# Altium schematic sheet P5V_Regulator.SchDoc: P5V DC/DC Converter
size 431 x 279 mm; Organization: ORGANIZATION; Address1: APPLIED PHYSICS LAB; Address2: UNIVERSITY OF WASHINGTON; Address3: 1013 NE 40TH STREET; Address4: SEATTLE, WA 98105; DocumentNumber: 6; Revision: -; SheetNumber: 6; SheetTotal: 18; ENG_APP_DATE: --/--/--; DSN_APP_DATE: --/--/--; CHK_APP_DATE: --/--/--
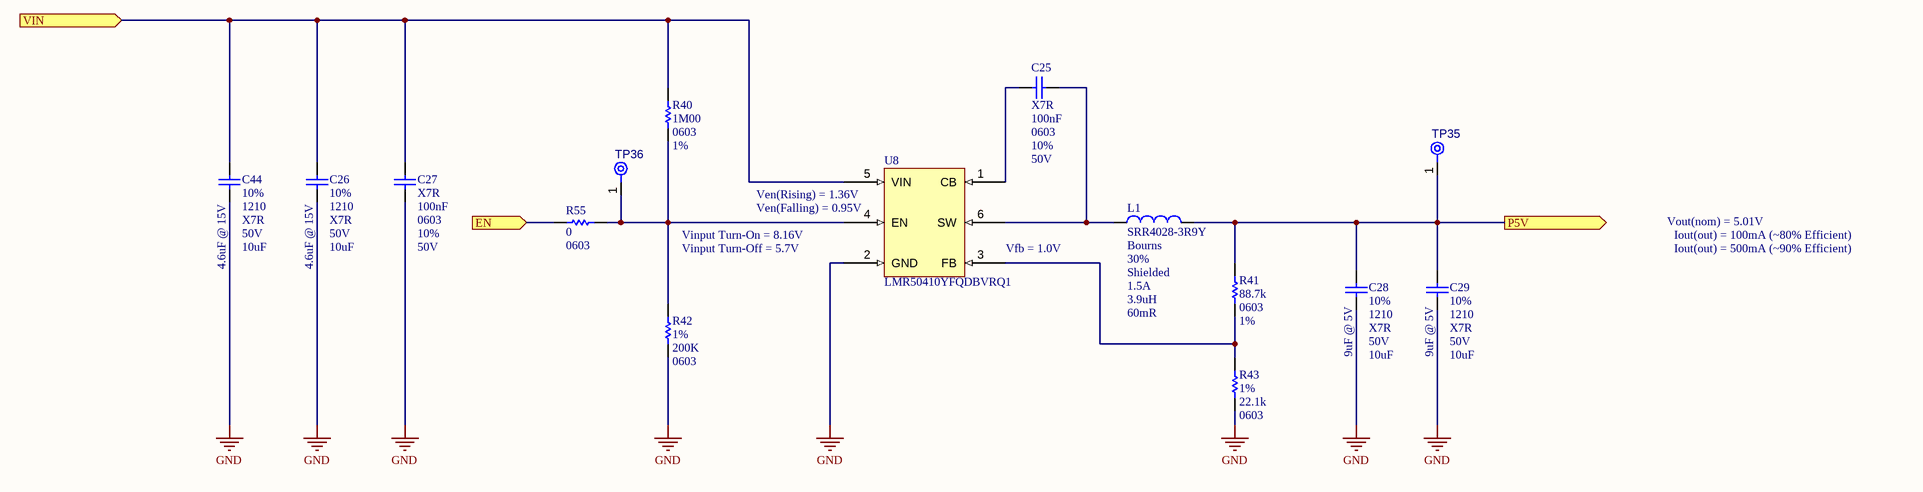
[diagram p0: P5V_Regulator.SchDoc]

## Parts
C25  value 100nF  Dielectric: X7R  Case/Package: 0603  Tolerance: 10%  Voltage Rating: 50V  [CAPC1608X90X40ML10T20]  (hidden comment: Capacitor 100nF +/- 10%, 50V, X7R, 0603)
C26  value 10uF  Tolerance: 10%  Case/Package: 1210  Dielectric: X7R  Voltage Rating: 50V  [CAPC3225X270X30ML30]  (hidden comment: Capacitor 10uF 10%, 50V, X7R, 1210)
C27  value 100nF  Dielectric: X7R  Case/Package: 0603  Tolerance: 10%  Voltage Rating: 50V  [CAPC1608X90X40ML10T20]  (hidden comment: Capacitor 100nF +/- 10%, 50V, X7R, 0603)
C28  value 10uF  Tolerance: 10%  Case/Package: 1210  Dielectric: X7R  Voltage Rating: 50V  [CAPC3225X270X30ML30]  (hidden comment: Capacitor 10uF 10%, 50V, X7R, 1210)
C29  value 10uF  Tolerance: 10%  Case/Package: 1210  Dielectric: X7R  Voltage Rating: 50V  [CAPC3225X270X30ML30]  (hidden comment: Capacitor 10uF 10%, 50V, X7R, 1210)
C44  value 10uF  Tolerance: 10%  Case/Package: 1210  Dielectric: X7R  Voltage Rating: 50V  [CAPC3225X270X30ML30]  (hidden comment: Capacitor 10uF 10%, 50V, X7R, 1210)
L1  SRR4028-3R9Y  Manufacturer: Bourns  Inductance Tolerance: 30%  Shielding: Shielded  Saturation Current: 1.5A  Inductance: 3.9uH  DC Resistance (DCR): 60mR  [INDP4848X30M]
R40  value 1M00  Case/Package: 0603  Tolerance: 1%  [RESC1609X50X30ML08T20]  (hidden comment: Resistor 1M +/-1% 0603 100 mW)
R41  value 88.7k  Case/Package: 0603  Tolerance: 1%  [RESC1608X55X25ML10T15]  (hidden comment: Resistor 88K7 +/-1% 0603 100 mW)
R42  value 200K  Tolerance: 1%  Case/Package: 0603  [RESC1609X50X30ML08T20]  (hidden comment: Resistor 200K +/-1% 0603 100 mW)
R43  value 22.1k  Tolerance: 1%  Case/Package: 0603  [RESC1608X55X25ML10T15]  (hidden comment: Resistor 22K1 +/-1% 0603 100 mW)
R55  value 0  Case/Package: 0603  [RESC1608X55X25ML10T15]  (hidden comment: Resistor 0R +/- 5% 0603 100 mW)
TP35  TPAD6R-CIRCLED  [TP06R - Circled]  (value not drawn)  (no BOM)
TP36  TPAD6R-CIRCLED  [TP06R - Circled]  (value not drawn)  (no BOM)
U8  LMR50410YFQDBVRQ1  [SOT95P280X145-6M]

## Ports
EN (in), P5V (out), VIN (in)

## Nets
GND: C26.1 C27.1 C28.1 C29.1 C44.1 R42.1 R43.1 U8.2(GND)
EN: R55.2 ; port EN
P5V: C28.2 C29.2 L1.2 R41.1 TP35.1(TP) ; port P5V
VIN: C26.2 C27.2 C44.2 R40.2 U8.5(VIN) ; port VIN
NetC25_1: C25.1 L1.1 U8.6(SW)
NetC25_2: C25.2 U8.1(CB)
NetR40_1: R40.1 R42.2 R55.1 TP36.1(TP) U8.4(EN)
NetR41_2: R41.2 R43.2 U8.3(FB)

## Notes on the sheet
- Vinput Turn-On = 8.16V
- (near U8) Ven(Rising) = 1.36V
- (near U8) Ven(Falling) = 0.95V
- Vout(nom) = 5.01V
- Iout(out) = 100mA (~80% Efficient)
- (near C44) 4.6uF @ 15V
- (near C26) 4.6uF @ 15V
- Vinput Turn-Off = 5.7V
- Vfb = 1.0V
- Iout(out) = 500mA (~90% Efficient)
- (near C28) 9uF @ 5V
- (near C29) 9uF @ 5V
- THIS DOCUMENT AND THE DATA DISCLOSED HEREIN OR HEREWITH IS THE PROPERTY OF APPLIED PHYSICS LAB - UNIVERSITY OF WASHINGTON.
- PROJECT
- TITLE
- FILE NAME
- SIZE
- B
- CAGE CODE
- DWG NO.
- SHEET
- OF
- REV

## Library data of the parts
C25 C27 = CMP-001-00206-10: Chip Capacitor, 100nF, +/- 10%, 50 V, X7R 0603 (1608 Metric); Capacitor Type: Ceramic; Pins: 2; RoHS Compliant: True; Max Operating Temperature: 125°C; Capacitance: 100nF; Min Operating Temperature: -55°C; Decade: 100nF; Mount: Surface Mount
C26 C28 C29 C44 = CMP-001-00184-10: Chip Capacitor, 10uF, 10%, 50 V, X7R 1210 (3225 Metric); Capacitor Type: Ceramic; Min Operating Temperature: -55°C; Max Operating Temperature: 125°C; Capacitance: 10uF; Decade: 10uF; Pins: 2; RoHS Compliant: True; Mount: Surface Mount
L1 = CMP-006-00033-4: Inductor Power Shielded Wirewound 3.9uH 30% 8.58 Q-Factor Ferrite 1.5A Saturation 60mROhm DCR; Decade: 1uH; Current Rating: 1.72A; Q Factor: 8.58; Self Resonant Frequency: 56MHz; Mount: Surface Mount; Series: SRR4028; Core Material: Ferrite; Min Operating Temperature: -40°C; Max Operating Temperature: 125°C; Case/Package: 2020
R40 = CMP-009-01187-3: Chip Resistor, 1M Ohm, +/- 1%, 0.1 W, -55 to 155 degC, 0603 (1608 Metric); Decade: 1MEG; Power: 100mW; Voltage Rating: 75V; RoHS Compliant: Yes; Max Operating Temperature: 155°C; Pins: 2; Min Operating Temperature: -55°C; Mount: Surface Mount
R41 = CMP-009-01025-4: Chip Resistor, 88.7k Ohm, +/- 1%, 0.1 W, -55 to 155 degC, 0603 (1608 Metric); Voltage Rating: 75V; Decade: 10k; Power: 100mW; Pins: 2; RoHS Compliant: True; Max Operating Temperature: 155°C; Min Operating Temperature: -55°C; Mount: Surface Mount
R42 = CMP-009-00904-2: Chip Resistor, 200k Ohm, +/- 1%, 0.1 W, -55 to 155 degC, 0603 (1608 Metric); Power: 100mW; Voltage Rating: 75V; Decade: 100k; RoHS Compliant: Yes; Max Operating Temperature: 155°C; Pins: 2; Min Operating Temperature: -55°C; Mount: Surface Mount
R43 = CMP-009-00967-4: Chip Resistor, 22.1k Ohm, +/- 1%, 0.1 W, -55 to 155 degC, 0603 (1608 Metric); Decade: 10k; Power: 100mW; Voltage Rating: 75V; Min Operating Temperature: -55°C; Pins: 2; RoHS Compliant: True; Max Operating Temperature: 155°C; Mount: Surface Mount
R55 = CMP-009-00006-7: Chip Resistor, 0 Ohm, 0.1 W, -55 to 155 degC, 0603 (1608 Metric); Voltage Rating: 50V; Power: 100mW; RoHS Compliant: True; Max Operating Temperature: 155°C; Tolerance: 5%; Min Operating Temperature: -55°C; Pins: 2; Mount: Surface Mount; Decade: 0
TP35 TP36 = CMP-00028-00014-3: 0.6mm round with a silkscreen circle.; Pins: 1
U8 = CMP-019-00074-3: Automotive qualified SIMPLE SWITCHER 4-V to 36-V, 1-A synchronous step-down converter 6-SOT-23 -40 to 150; Max Input Voltage: 4V; Switching Frequency: 0.7MHz; Min Output Voltage: 28V; Max Output Current: 1; Min Input Voltage: 36V; Isolation: No; Max Output Voltage: 1V; Min Operating Temperature: +150; Isolation Voltage: N/A; Nominal Output Voltage: N/A; Case/Package: SOT-23-6; Mount: Surface Mount; Max Operating Temperature: -40; Max Power Dissipation: N/A